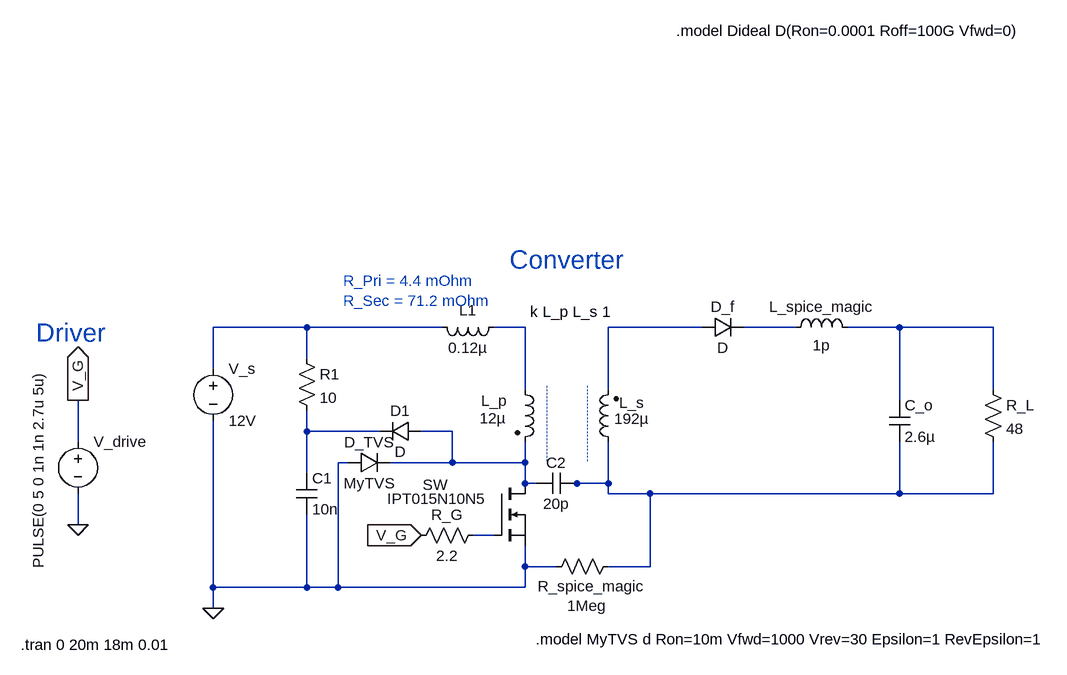
[diagram p0: schematic Flyback_v3.asc]
Flyback_v3.asc, the LTspice schematic file:
Version 4
SHEET 1 1336 14152
WIRE -128 256 -272 256
WIRE 80 256 -128 256
WIRE 208 256 160 256
WIRE 480 256 336 256
WIRE 624 256 544 256
WIRE 784 256 704 256
WIRE 928 256 784 256
WIRE -128 304 -128 256
WIRE -272 320 -272 256
WIRE 208 352 208 256
WIRE 336 352 336 256
WIRE 928 352 928 256
WIRE 784 368 784 256
WIRE -128 416 -128 384
WIRE -16 416 -128 416
WIRE 96 416 48 416
WIRE -480 432 -480 368
WIRE -64 464 -80 464
WIRE 96 464 96 416
WIRE 96 464 0 464
WIRE 208 464 208 432
WIRE 208 464 96 464
WIRE -128 480 -128 416
WIRE 208 496 208 464
WIRE 224 496 208 496
WIRE 288 496 272 496
WIRE 336 496 336 432
WIRE 336 496 288 496
WIRE 336 512 336 496
WIRE 400 512 336 512
WIRE 784 512 784 432
WIRE 784 512 400 512
WIRE 928 512 928 432
WIRE 928 512 784 512
WIRE -480 560 -480 512
WIRE 160 576 128 576
WIRE 208 624 208 592
WIRE 256 624 208 624
WIRE 400 624 400 512
WIRE 400 624 336 624
WIRE -272 656 -272 400
WIRE -128 656 -128 544
WIRE -128 656 -272 656
WIRE -80 656 -80 464
WIRE -80 656 -128 656
WIRE 208 656 208 624
WIRE 208 656 -80 656
WIRE -272 688 -272 656
FLAG -272 688 0
FLAG 48 576 V_G
IOPIN 48 576 In
FLAG -480 560 0
FLAG -480 368 V_G
IOPIN -480 368 Out
SYMBOL voltage -272 304 R0
WINDOW 123 0 0 Left 0
WINDOW 39 0 0 Left 0
SYMATTR InstName V_s
SYMATTR Value 12V
SYMBOL res 912 336 R0
SYMATTR InstName R_L
SYMATTR Value 48
SYMBOL cap 768 368 R0
SYMATTR InstName C_o
SYMATTR Value 2.6µ
SYMATTR SpiceLine Rser=30m
SYMBOL diode 480 272 R270
WINDOW 0 32 32 VTop 2
WINDOW 3 0 32 VBottom 2
SYMATTR InstName D_f
SYMBOL nmos 160 496 R0
WINDOW 0 -110 2 Left 2
WINDOW 3 -164 24 Left 2
SYMATTR InstName SW
SYMATTR Value IPT015N10N5
SYMBOL ind2 192 336 R0
WINDOW 0 -52 33 Left 2
WINDOW 3 -54 60 Left 2
SYMATTR InstName L_p
SYMATTR Value 12µ
SYMATTR Type ind
SYMATTR SpiceLine Rser=4.4m
SYMBOL ind2 352 448 R180
WINDOW 0 -40 76 Left 2
WINDOW 3 -47 51 Left 2
SYMATTR InstName L_s
SYMATTR Value 192µ
SYMATTR Type ind
SYMATTR SpiceLine Rser=71.2m
SYMBOL voltage -480 416 R0
WINDOW 3 -61 211 VLeft 2
WINDOW 123 0 0 Left 0
WINDOW 39 0 0 Left 0
SYMATTR Value PULSE(0 5 0 1n 1n 2.7u 5u)
SYMATTR InstName V_drive
SYMBOL res 352 608 R90
WINDOW 0 62 42 VBottom 2
WINDOW 3 61 49 VTop 2
SYMATTR InstName R_spice_magic
SYMATTR Value 1Meg
SYMBOL ind 608 272 R270
WINDOW 0 32 56 VTop 2
WINDOW 3 4 56 VBottom 2
SYMATTR InstName L_spice_magic
SYMATTR Value 1p
SYMATTR SpiceLine Rser=3m
SYMBOL cap 288 480 R90
WINDOW 0 0 32 VBottom 2
WINDOW 3 32 32 VTop 2
SYMATTR InstName C2
SYMATTR Value 20p
SYMBOL res 144 560 R90
WINDOW 0 0 56 VBottom 2
WINDOW 3 32 56 VTop 2
SYMATTR InstName R_G
SYMATTR Value 2.2
SYMBOL diode -64 480 R270
WINDOW 0 32 32 VTop 2
WINDOW 3 0 32 VBottom 2
SYMATTR InstName D_TVS
SYMATTR Value MyTVS
SYMBOL ind 176 240 R90
WINDOW 0 5 56 VBottom 2
WINDOW 3 32 56 VTop 2
SYMATTR InstName L1
SYMATTR Value 0.12µ
SYMBOL res -144 288 R0
SYMATTR InstName R1
SYMATTR Value 10
SYMBOL cap -144 480 R0
SYMATTR InstName C1
SYMATTR Value 10n
SYMBOL diode 48 400 R90
WINDOW 0 0 32 VBottom 2
WINDOW 3 32 32 VTop 2
SYMATTR InstName D1
TEXT 216 232 Left 2 !k L_p L_s 1
TEXT 240 464 VLeft 1 ;----------------------\n \n \n----------------------
TEXT 184 152 Left 4 ;Converter
TEXT -544 264 Left 4 ;Driver
TEXT -568 744 Left 2 !.tran 0 20m 18m 0.01
TEXT 440 -200 Left 2 !.model Dideal D(Ron=0.0001 Roff=100G Vfwd=0)
TEXT -72 184 Left 2 ;R_Pri = 4.4 mOhm\nR_Sec = 71.2 mOhm
TEXT 224 736 Left 2 !.model MyTVS d Ron=10m Vfwd=1000 Vrev=30 Epsilon=1 RevEpsilon=1

The netlist it stands for:
* Flyback_v3.asc
V_s N001 0 12V
R_L N005 N008 48
C_o N005 N008 2.6µ Rser=30m
D_f N003 N004 D
M§SW N007 N009 0 0 IPT015N10N5
L_p N002 N007 12µ Rser=4.4m
L_s N008 N003 192µ Rser=71.2m
V_drive V_G 0 PULSE(0 5 0 1n 1n 2.7u 5u)
R_spice_magic N008 0 1Meg
L_spice_magic N004 N005 1p Rser=3m
C2 N008 N007 20p
R_G N009 V_G 2.2
D_TVS 0 N007 MyTVS
L1 N002 N001 0.12µ
R1 N001 N006 10
C1 N006 0 10n
D1 N007 N006 D
.model D D
.lib standard.dio
.model NMOS NMOS
.model PMOS PMOS
.lib standard.mos
k L_p L_s 1
* ----------------------
* ----------------------
* Converter
* Driver
.tran 0 20m 18m 0.01
.model Dideal D(Ron=0.0001 Roff=100G Vfwd=0)
* R_Pri = 4.4 mOhm
* R_Sec = 71.2 mOhm
.model MyTVS d Ron=10m Vfwd=1000 Vrev=30 Epsilon=1 RevEpsilon=1
.backanno
.end